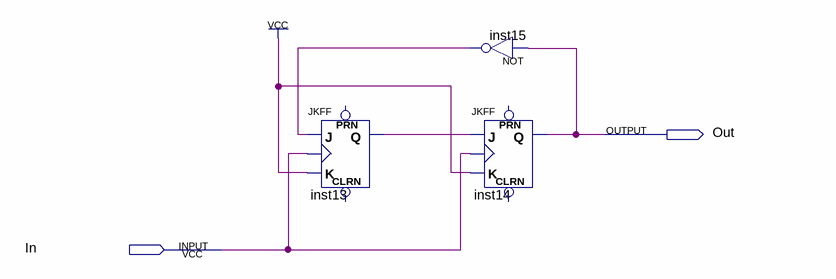
[diagram p0: schematic sheet]
// Quartus schematic Divizor_3.bdf as structural Verilog: 3 symbols, 2 pins
module Divizor_3 (
  input  In,
  output Out
);

  wire inst13_q, inst15_out;

  JKFF inst13 (.K(1'b1), .J(inst15_out), .CLK(In), .Q(inst13_q));  // open: PRN, CLRN
  not inst15 (inst15_out, Out);
  JKFF inst14 (.K(1'b1), .J(inst13_q), .CLK(In), .Q(Out));  // open: PRN, CLRN
endmodule
